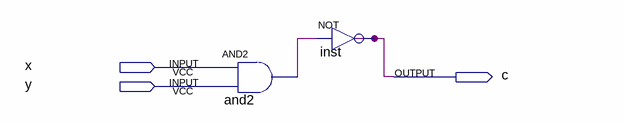
[diagram p0: schematic sheet]
// Quartus schematic test4.bdf as structural Verilog: 2 symbols, 3 pins
module test4 (
  input  x,
  input  y,
  output c
);

  wire and2_out;

  and and2 (and2_out, x, y);
  not inst (c, and2_out);
endmodule
